# Altium schematic sheet DC309A_FTDI(DNI).SchDoc: FTDI(DNI)
size 558 x 431 mm; Date: Not shown in title block; ApprovedBy: Not shown in title block; CheckedBy: Not shown in title block; Author: Not shown in title block; CompanyName: Not shown in title block; DrawnBy: KAVIKANNAN; Engineer: Not shown in title block; Organization: Not shown in title block; Address1: Not shown in title block; Address2: Not shown in title block; Address3: Not shown in title block; Address4: Not shown in title block; DocumentNumber: 10; Revision: Use project parameter SCH_Rev; SheetNumber: 10; SheetTotal: 11; PageSetup: Record=PageOptions|CenterHorizontal=True|CenterVertical=True|PrintScale=1.00|XCorrection=1.00|YCorrection=1.00|PrintKind=0|BorderSize=5000000|LeftOffset=0|BottomOffset=0|Orientation=2|PaperLength=1000|PaperWidth=1000|Scale=100|PaperSource=15|PrintQuality=600|MediaType=1|DitherType=10|PaperKind=Letter|PrintScaleMode=1; CurrentTime: Not shown in title block; CurrentDate: Not shown in title block; Time: Not shown in title block; DocumentFullPathAndName: Not shown in title block; DocumentName: Not shown in title block; ModifiedDate: Not shown in title block; ImagePath: Not shown in title block
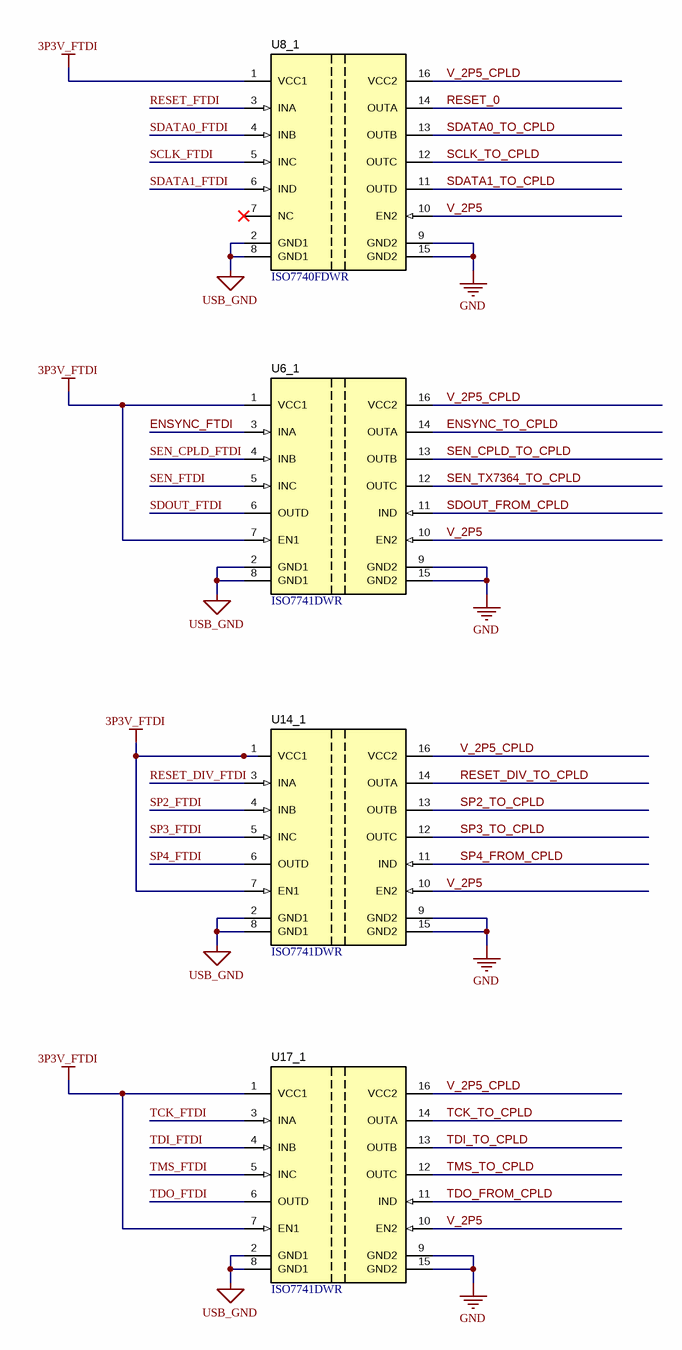
[diagram p0: DC309A_FTDI(DNI).SchDoc]

## Parts
U6_1  ISO7741DWR  [DW0016B_HV]
U8_1  ISO7740FDWR  [DW0016B_HV]
U14_1  ISO7741DWR  [DW0016B_HV]
U17_1  ISO7741DWR  [DW0016B_HV]

## Nets
3P3V_FTDI: U6_1.1(VCC1) U6_1.7(EN1) U8_1.1(VCC1) U14_1.1(VCC1) U14_1.7(EN1) U17_1.1(VCC1) U17_1.7(EN1)
GND: U6_1.9(GND2) U6_1.15(GND2) U8_1.9(GND2) U8_1.15(GND2) U14_1.9(GND2) U14_1.15(GND2) U17_1.9(GND2) U17_1.15(GND2)
USB_GND: U6_1.2(GND1) U6_1.8(GND1) U8_1.2(GND1) U8_1.8(GND1) U14_1.2(GND1) U14_1.8(GND1) U17_1.2(GND1) U17_1.8(GND1)
ENSYNC_FTDI: U6_1.3(INA)
ENSYNC_TO_CPLD: U6_1.14(OUTA)
RESET_0: U8_1.14(OUTA)
RESET_DIV_FTDI: U14_1.3(INA)
RESET_DIV_TO_CPLD: U14_1.14(OUTA)
RESET_FTDI: U8_1.3(INA)
SCLK_FTDI: U8_1.5(INC)
SCLK_TO_CPLD: U8_1.12(OUTC)
SDATA0_FTDI: U8_1.4(INB)
SDATA0_TO_CPLD: U8_1.13(OUTB)
SDATA1_FTDI: U8_1.6(IND)
SDATA1_TO_CPLD: U8_1.11(OUTD)
SDOUT_FROM_CPLD: U6_1.11(IND)
SDOUT_FTDI: U6_1.6(OUTD)
SEN_CPLD_FTDI: U6_1.4(INB)
SEN_CPLD_TO_CPLD: U6_1.13(OUTB)
SEN_FTDI: U6_1.5(INC)
SEN_TX7364_TO_CPLD: U6_1.12(OUTC)
SP2_FTDI: U14_1.4(INB)
SP2_TO_CPLD: U14_1.13(OUTB)
SP3_FTDI: U14_1.5(INC)
SP3_TO_CPLD: U14_1.12(OUTC)
SP4_FROM_CPLD: U14_1.11(IND)
SP4_FTDI: U14_1.6(OUTD)
TCK_FTDI: U17_1.3(INA)
TCK_TO_CPLD: U17_1.14(OUTA)
TDI_FTDI: U17_1.4(INB)
TDI_TO_CPLD: U17_1.13(OUTB)
TDO_FROM_CPLD: U17_1.11(IND)
TDO_FTDI: U17_1.6(OUTD)
TMS_FTDI: U17_1.5(INC)
TMS_TO_CPLD: U17_1.12(OUTC)
V_2P5: U6_1.10(EN2) U8_1.10(EN2) U14_1.10(EN2) U17_1.10(EN2)
V_2P5_CPLD: U6_1.16(VCC2) U8_1.16(VCC2) U14_1.16(VCC2) U17_1.16(VCC2)

Not connected (* = marked no-connect by the designer): U8_1 7(NC)*

## Notes on the sheet
- Drawn By:
- SVN Rev:
- Number:
- TID #:
- Orderable:
- Rev:
- Sheet Title:
- File:
- Project Title:
- Designed for:
- Assembly Variant:
- Mod. Date:
- Sheet:
- Size:
- of
- C
- http://www.ti.com
- Texas Instruments and/or its licensors do not warrant the accuracy or completeness of this specification or any information contained therein. Texas Instruments and/or its licensors do not warrant that this design will meet the specifications, will be suitable for your application or fit for any particular purpose, or will operate in an implementation. Texas Instruments and/or its licensors do not warrant that the design is production worthy. You should completely validate and test your design implementation to confirm the system functionality for your application.
- Engineer:
- Contact:
- © Texas Instruments

## Library data of the parts
U6_1 U14_1 U17_1 = CMP-0076064-3: High-Speed, Low-Power, Robust EMC Quad-Channel Digital Isolator, DW0016B (SOIC-16); Alternate Manufacturer: Texas Instruments; Green_Lifecycle: Active; SizeAreaWB_mm2: 152.52; Green_REACh: Passed; SizeZ_mm: 2.65; SizeX_mm: 10.4; SizeY_mm: 10.3; SizeArea_mm2: 107.12; CompType: IC; AEC Category: Q200; AEC Qualified: N; Rating: Catalog; ComponentLink1URL: http://www.ti.com/lit/ds/symlink/iso7741.pdf; Alternate PartNumber: ISO7741DW; PackageDescription: SOIC-16; RoHS: Y; MountType: SMT; Green_EU RoHS-2: Passed; Manufacturer: Texas Instruments; PackageReference: DW0016B; PartNumber: ISO7741DWR; ComponentLink1Description: Datasheet Link; ComponentLink2Description: Product Folder; ComponentLink2URL: http://www.ti.com/product/iso7741; ComponentLink3Description: Online Datasheet; ComponentLink3URL: http://www.ti.com/product/iso7741/datasheet; Operating Temperature Range: -55 to 125 C
U8_1 = CMP-0084707-2: High-Speed, Low-Power, Robust EMC Quad-Channel Digital Isolator, DW0016B (SOIC-16); Alternate Manufacturer: Texas Instruments; SizeX_mm: 10.4; CompType: IC; SizeArea_mm2: 107.12; Rating: Catalog; SizeY_mm: 10.3; AEC Category: Q200; SizeZ_mm: 2.65; AEC Qualified: N; SizeAreaWB_mm2: 152.52; Alternate PartNumber: ISO7740FDW; PartNumber: ISO7740FDWR; PackageReference: DW0016B; PackageDescription: SOIC-16; ComponentLink3Description: Online Datasheet; Operating Temperature Range: -55 to 125 C; Manufacturer: Texas Instruments; ComponentLink2Description: Product Folder; ComponentLink3URL: http://www.ti.com/product/iso7740/datasheet; ComponentLink1Description: Datasheet Link; ComponentLink1URL: http://www.ti.com/lit/ds/symlink/iso7740.pdf; MountType: SMT; ComponentLink2URL: http://www.ti.com/product/iso7740; RoHS: Y